# Altium schematic sheet Control_Motor_Ciruit.SchDoc
size A2; Organization: Altium Limited; Address1: L3, 12a Rodborough Rd; Address2: Frenchs Forest; Address3: NSW; Address4: Australia 2086
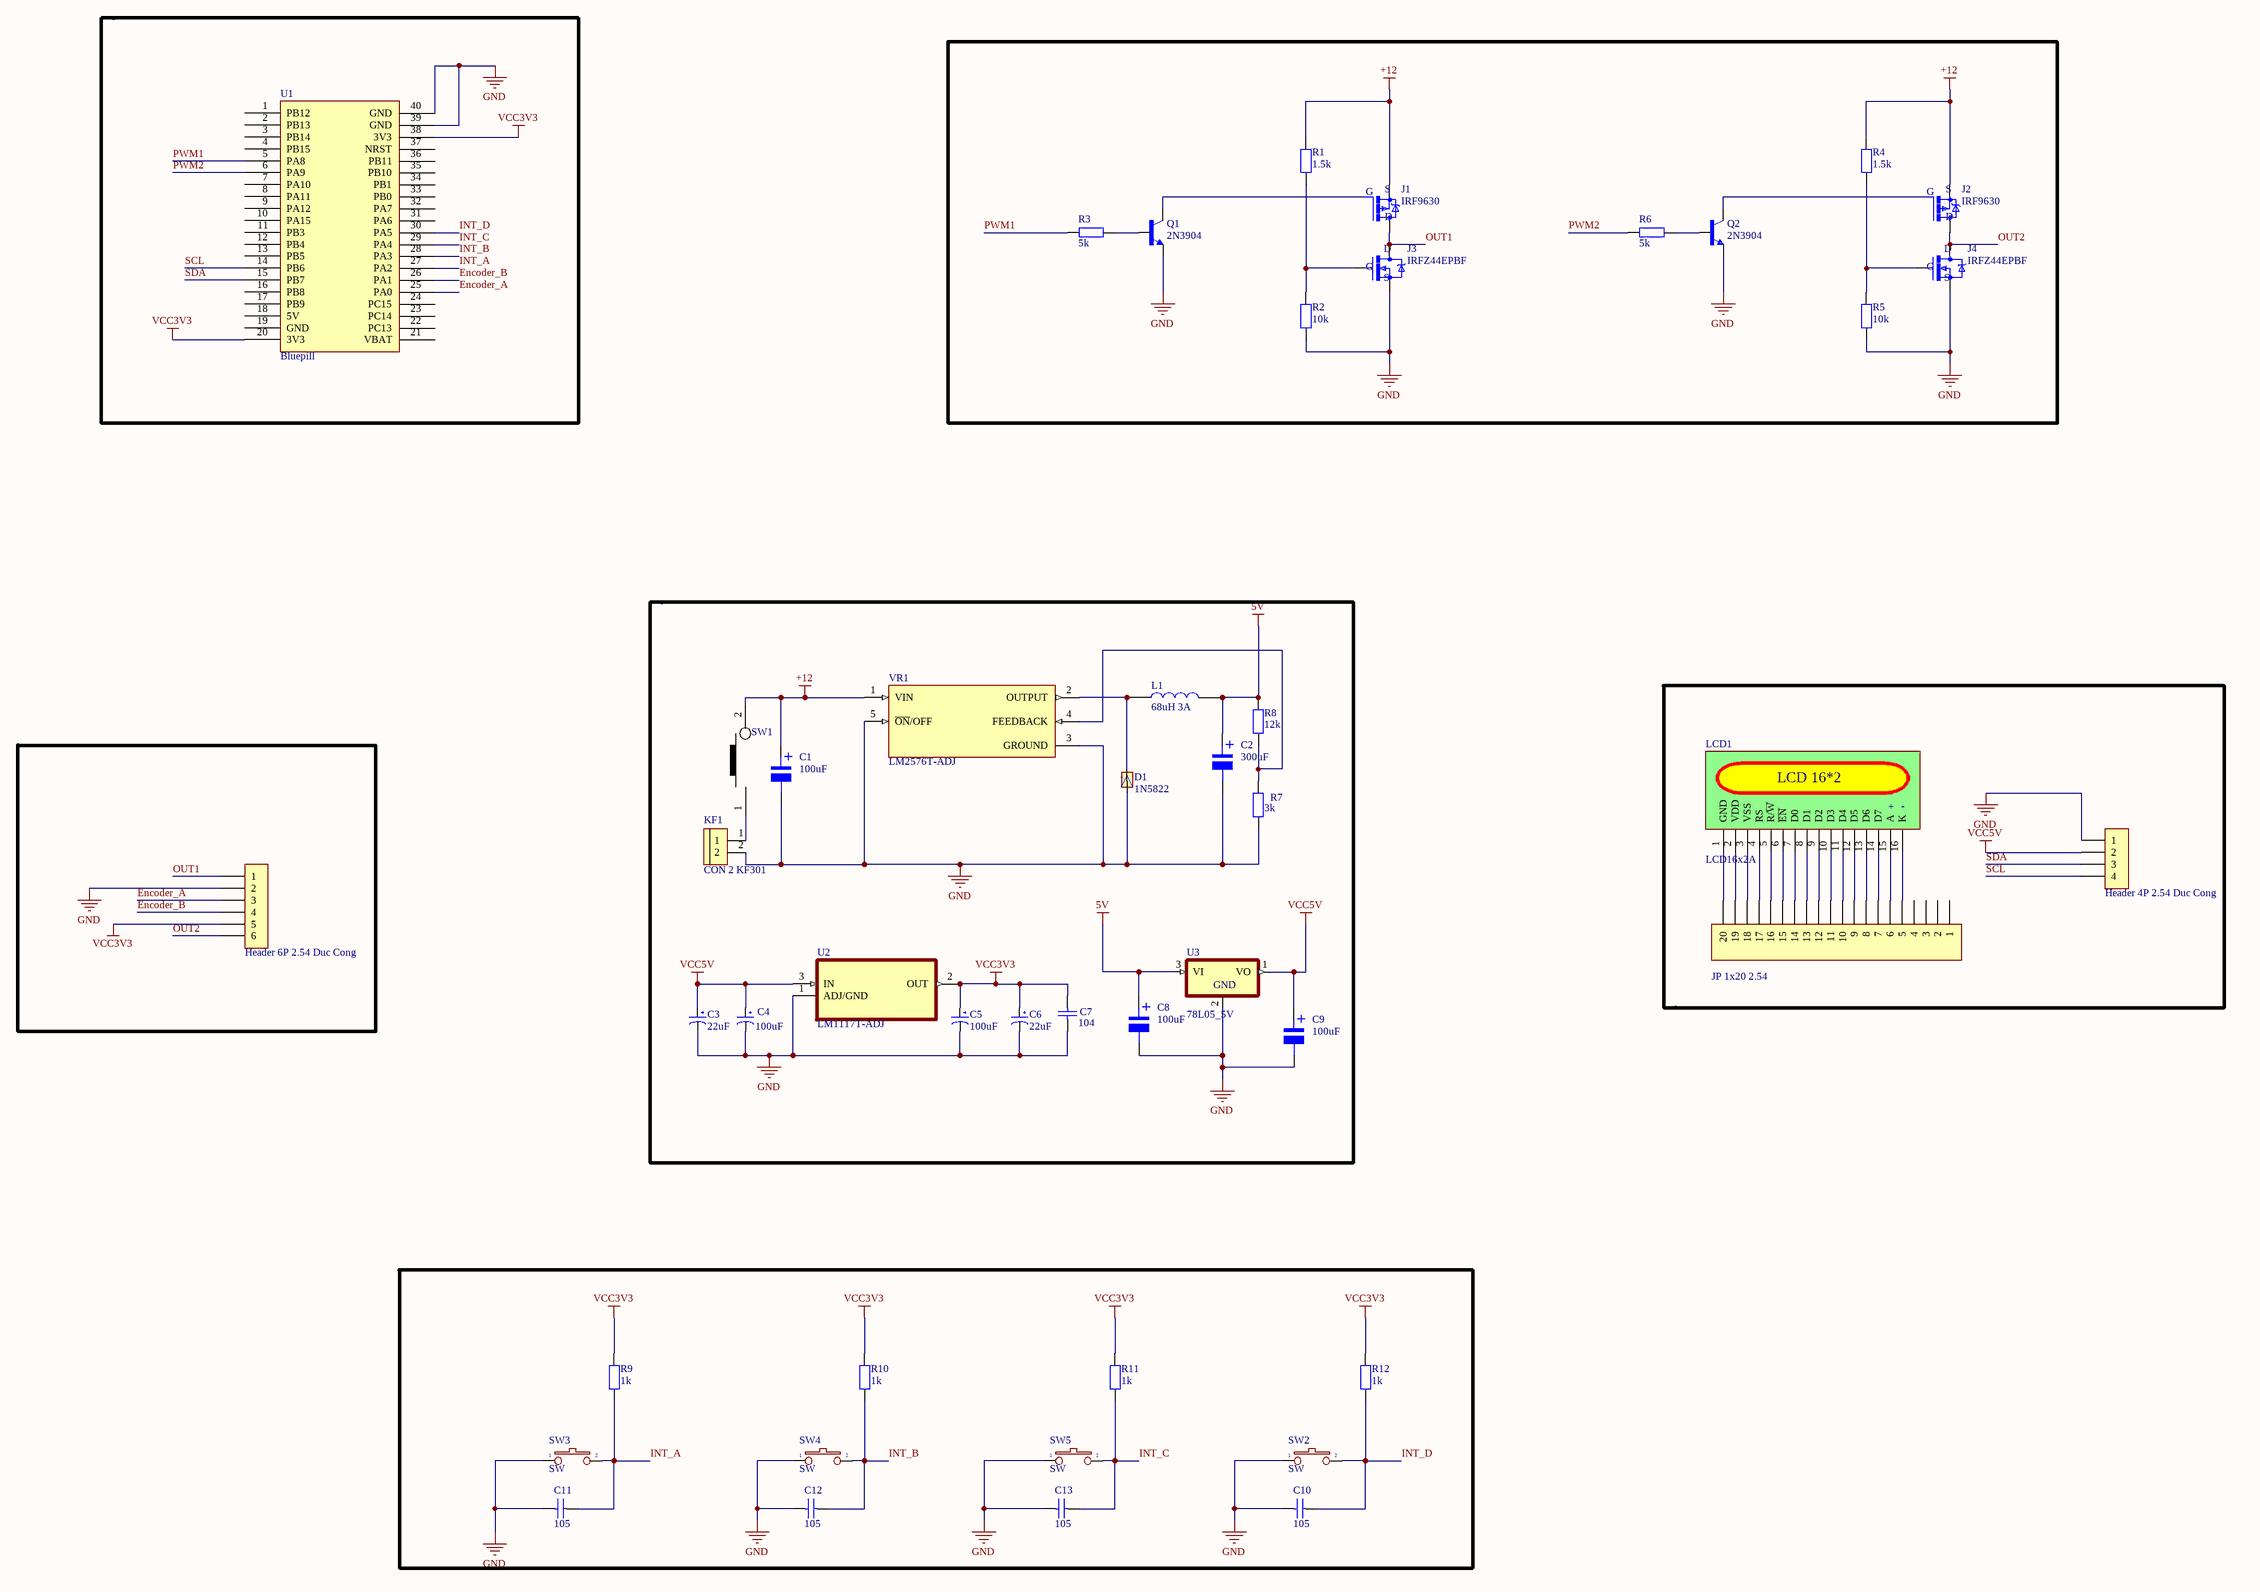
[diagram p0: Control_Motor_Ciruit.SchDoc]

## Parts
C1  100uF  [CA-ALU-5R]
C2  300uF  [CA-ALU-5R]
C3  22uF  [CA-ALU-5R]
C4  100uF  [CA-ALU-5R]
C5  100uF  [CA-ALU-5R]
C6  22uF  [CA-ALU-5R]
C7  104  [CN1]
C8  100uF  [CA-ALU-5R]
C9  100uF  [CA-ALU-5R]
C10  105  [tu gom]
C11  105  [tu gom]
C12  105  [tu gom]
C13  105  [tu gom]
D1  1N5822  [DIOAD2120W130L950D530P]
H1  Header 4P 2.54 Duc Cong  [Header 4P DC 2.54]
H?  Header 6P 2.54 Duc Cong  [Header 6P DC 2.54]
J1  IRF9630  [TO220V]
J2  IRF9630  [TO220V]
J3  IRFZ44EPBF  [TO-220]
J4  IRFZ44EPBF  [TO-220]
JP1  JP 1x20 2.54  [JP 1x20 CT]
KF1  CON 2 KF301  [Con 2 KF301 5.08]
L1  68uH 3A  [CUON CAM 100uH3A]
LCD1  LCD16x2A  [LCD16X2]
Q1  2N3904  [TO92127P495H495-3]
Q2  2N3904  [TO92127P495H495-3]
R1  1.5k  [tro vach 1/4w]
R2  10k  [tro vach 1/4w]
R3  5k  [tro vach 1/4w]
R4  1.5k  [tro vach 1/4w]
R5  10k  [tro vach 1/4w]
R6  5k  [tro vach 1/4w]
R7  3k  [tro vach 1/4w]
R8  12k  [tro vach 1/4w]
R9  1k  [tro vach 1/4w]
R10  1k  [tro vach 1/4w]
R11  1k  [tro vach 1/4w]
R12  1k  [tro vach 1/4w]
SW1  SWITCH 10A-2PIN  [SW_2ARS_TH]  (value not drawn)
SW2  SW  [SW2]
SW3  SW  [SW2]
SW4  SW  [SW2]
SW5  SW  [SW2]
U1  Bluepill  [Blue Pill]
U2  LM1117T-ADJ  [TO254P470X1016X2222-3P]
U3  78L05_5V  [TO-92]
VR1  LM2576T-ADJ  [TO170P1067X483X1651-5]

## Nets
5V: C2.1 C8.1 L1.2 R8.2 U3.3(VI)
+12: C1.1 J1.3(S) J2.3(S) R1.2 R4.2 SW1.2 VR1.1(VIN)
GND: C1.2 C2.2 C3.2 C4.2 C5.2 C6.2 C7.2 C8.2 C9.2 C10.2 C11.2 C12.2 C13.2 D1.A H1.1 H?.2 J3.3(S) J4.3(S) KF1.2 Q1.1(E) Q2.1(E) R2.1 R5.1 R7.1 SW2.1 SW3.1 SW4.1 SW5.1 U1.39(GND) U1.40(GND) U2.1(ADJ/GND) U3.2(GND) VR1.3(GROUND) VR1.5(~{ON}/OFF)
VCC3V3: C5.1 C6.1 C7.1 H?.5 R9.2 R10.2 R11.2 R12.2 U1.20(3V3) U1.38(3V3) U2.2(OUT)
VCC5V: C3.1 C4.1 C9.1 H1.2 U2.3(IN) U3.1(VO)
Encoder_A: H?.3 U1.25(PA0)
Encoder_B: H?.4 U1.26(PA1)
INT_A: C11.1 R9.1 SW3.2 U1.27(PA2)
INT_B: C12.1 R10.1 SW4.2 U1.28(PA3)
INT_C: C13.1 R11.1 SW5.2 U1.29(PA4)
INT_D: C10.1 R12.1 SW2.2 U1.30(PA5)
OUT1: H?.1 J1.2(D) J3.2(D)
OUT2: H?.6 J2.2(D) J4.2(D)
PWM1: R3.2 U1.5(PA8)
PWM2: R6.2 U1.6(PA9)
SCL: H1.4 U1.14(PB6)
SDA: H1.3 U1.15(PB7)
NetD1_C: D1.C L1.1 VR1.2(OUTPUT)
NetJ1_1: J1.1(G) Q1.3(C)
NetJ2_1: J2.1(G) Q2.3(C)
NetJ3_1: J3.1(G) R1.1 R2.2
NetJ4_1: J4.1(G) R4.1 R5.2
NetJP1_5: JP1.5 LCD1.16(K)
NetJP1_6: JP1.6 LCD1.15(A)
NetJP1_7: JP1.7 LCD1.14(D7)
NetJP1_8: JP1.8 LCD1.13(D6)
NetJP1_9: JP1.9 LCD1.12(D5)
NetJP1_10: JP1.10 LCD1.11(D4)
NetJP1_11: JP1.11 LCD1.10(D3)
NetJP1_12: JP1.12 LCD1.9(D2)
NetJP1_13: JP1.13 LCD1.8(D1)
NetJP1_14: JP1.14 LCD1.7(D0)
NetJP1_15: JP1.15 LCD1.6(~{EN})
NetJP1_16: JP1.16 LCD1.5(R/~{W})
NetJP1_17: JP1.17 LCD1.4(RS)
NetJP1_18: JP1.18 LCD1.3(VSS)
NetJP1_19: JP1.19 LCD1.2(VDD)
NetJP1_20: JP1.20 LCD1.1(GND)
NetKF1_1: KF1.1 SW1.1
NetQ1_2: Q1.2(B) R3.1
NetQ2_2: Q2.2(B) R6.1
NetR7_2: R7.2 R8.1 VR1.4(FEEDBACK)

Not connected (* = marked no-connect by the designer): JP1 1 2 3 4; U1 1(PB12) 2(PB13) 3(PB14) 4(PB15) 7(PA10) 8(PA11) 9(PA12) 10(PA15) 11(PB3) 12(PB4) 13(PB5) 16(PB8) 17(PB9) 18(5V) 19(GND) 21(VBAT) 22(PC13) 23(PC14) 24(PC15) 31(PA6) 32(PA7) 33(PB0) 34(PB1) 35(PB10) 36(PB11) 37(NRST)

## Notes on the sheet
- Title
- Size:
- Date:
- File:
- A2
- Number:
- Time:
- Revision:
- Sheet
- of
- (in symbol LCD16x2) LCD 16*2; -; +
- (in symbol Tu Nhom 100uF 16V) +

## Library data of the parts
C1 C2 C8 C9 = Tu Nhom 100uF 16V: Dán; Don_Vi: Con; So_Chan: 2; Ten_Linh_Kien: Tụ Nhôm 100uF 16V 6.3x5.4MM; Ma_Hang: MH002219; Chung_Loai: Dán; Kieu_Chan: *
C3 C6 = Tu tantalum 22uF 25V SMD6032: Dán; Don_Vi: Con; So_Chan: 2; Ten_Linh_Kien: Tụ tantalum 226E-22uF 25V SMD6032; Ma_Hang: MH002651; Chung_Loai: Dán; Kieu_Chan: *
C4 C5 = Tu tantalum 100uF 10V SMD6032: Dán; Don_Vi: Con; So_Chan: 2; Ten_Linh_Kien: Tụ tantalum 107A-100uF 10V SMD6032; Ma_Hang: MH007594; Chung_Loai: Dán; Kieu_Chan: *
C7 = Tu 0603 104 50V 10%: Dán; Don_Vi: Con; So_Chan: 2; Ten_Linh_Kien: Tụ 0603 104-100nF 10% 50V; Ma_Hang: MH004568; Chung_Loai: Dán; Kieu_Chan: *
C10-C13 = Tu gom 104 50V: Cắm; So_Chan: 2; Ten_Linh_Kien: Tụ gốm 104 100nF 50V; Don_Vi: Con; Ma_Hang: MH004761; Chung_Loai: Cắm; Kieu_Chan: *
D1 = 1N5822: Diode Schottky 40 V 3A Through Hole DO-201AD; MF: STMicroelectronics; Value: *; SnapEDA_Link: https://www.snapeda.com/parts/1N5822/STMicroelectronics/view-part/?ref=snap; Purchase-URL: https://pricing.snapeda.com/search/part/1N5822/?ref=eda; Availability: In Stock; Price: None; Package: DO-201 STMicroelectronics; Check_prices: https://www.snapeda.com/parts/1N5822/STMicroelectronics/view-part/?ref=eda; MP: 1N5822
H1 = Header 4P 2.54 Duc Cong: Cắm; Ten_Linh_Kien: Header 4P XH2.54-4P Đực Cong; Don_Vi: Con; Ma_Hang: MH001310; Chung_Loai: Cắm
H? = Header 6P 2.54 Duc Cong: Cắm; Ten_Linh_Kien: Header 6P XH2.54-6P Đực Cong; Don_Vi: Con; Ma_Hang: MH003363; Chung_Loai: Cắm
J1 J2 = IRF9630: Trans MOSFET P-CH 200V 6.5A 3-Pin(3+Tab) TO-220AB Trans MOSFET P-CH 200V 6.5A 3-Pin(3+Tab) TO-220AB Trans MOSFET P-CH 200V 6.5A 3-Pin(3+Tab) TO-220AB; MF: Vishay Siliconix; MP: IRF9630; SnapEDA_Link: https://www.snapeda.com/parts/IRF9630/Vishay+Siliconix/view-part/?ref=snap; Availability: In Stock; Package: TO-220-3 Vishay; Purchase-URL: https://pricing.snapeda.com/search/part/IRF9630/?ref=eda; Check_prices: https://www.snapeda.com/parts/IRF9630/Vishay+Siliconix/view-part/?ref=eda; Value: *; Price: None
J3 J4 = IRFZ44EPBF: N-Channel 60 V 48A (Tc) 110W (Tc) Through Hole TO-220AB; MF: Infineon; Purchase-URL: https://pricing.snapeda.com/search/part/IRFZ44EPBF/?ref=eda; MP: IRFZ44EPBF; Value: *; Check_prices: https://www.snapeda.com/parts/IRFZ44EPBF/Infineon+Technologies/view-part/?ref=eda; Package: TO-220-3 Infineon; Price: None; Availability: In Stock; SnapEDA_Link: https://www.snapeda.com/parts/IRFZ44EPBF/Infineon+Technologies/view-part/?ref=snap
JP1 = JP 1x20 2.54 Cai Thang: Cắm; Ten_Linh_Kien: Jump Đơn Cái 2.54MM 1x20P Thẳng; Don_Vi: Con; Ma_Hang: MH004006; Ghi_Chu: *; Kieu_Chan: *; Chung_Loai: Cắm
KF1 = CON 2 KF301: Cắm; Ma_Hang: MH000987; Ten_Linh_Kien: CON 2 KF301-2P 5.08MM Xanh Dương; Chung_Loai: Cắm; Ghi_Chu: *; Kieu_Chan: *; Don_Vi: Con
L1 = CUON CAM 100uH DIP: Dán; Don_Vi: Con; Ma_Hang: MH002209; Ten_Linh_Kien: Cuộn Cảm 100uH 3A 8x10MM; Chung_Loai: Dán; Ghi Chu: *; Kieu Chan: *
LCD1 = LCD16x2: LCD dipslay 16 char, 2 line; Value: LCD16x2A
Q1 Q2 = 2N3904: TRANS NPN 40V 200MA TO92-3; MF: Rectron; SnapEDA_Link: https://www.snapeda.com/parts/2N3904/Rectron/view-part/?ref=snap; Package: TO-226-3 Rectron; MP: 2N3904; Check_prices: https://www.snapeda.com/parts/2N3904/Rectron/view-part/?ref=eda; Purchase-URL: https://pricing.snapeda.com/search/part/2N3904/?ref=eda; Price: None; Value: *; Availability: In Stock
R1 R3 R4 R6 = Tro Vach 1/4W 5% 1.5k: Cắm; Don_Vi: Con; So_Chan: 2; Ten_Linh_Kien: Trở Vạch 1/4w 5% 1.5k; Ma_Hang: MH007284; Chung_Loai: Cắm; Kieu_Chan: *
R2 R5 R9-R12 = Tro Vach 1/4W 5% 10k: Căm; Chung_Loai: Cắm; Don_Vi: Con; So_Chan: 2; Ten_Linh_Kien: Trở Vạch 1/4w 5% 10K; Ma_Hang: MH007354; Kieu_Chan: *
R7 = Tro Vach 1/4W 5% 2.2k: Cắm; Don_Vi: Con; So_Chan: 2; Ten_Linh_Kien: Trở Vạch 1/4w 5% 2.2k; Ma_Hang: MH007293; Chung_Loai: Cắm; Kieu_Chan: *
R8 = Tro Vach 1/4W 5% 12k: Cắm; Don_Vi: Con; So_Chan: 2; Ma_Hang: MH007389; Ten_Linh_Kien: Trở Vạch 1/4w 5% 12k; Chung_Loai: Cắm; Kieu_Chan: *
SW1 = SW1_RS-471005264153-TH: Rocker Switch SPST 16A (AC), 10A (DC) 250V Panel Mount, Snap-In; Manufacturer: Würth Elektronik; Alternate Part Number-1: NA; Manufacturer Part Number: 471005264153; Case/Package: TH; Supplier-1: Würth Elektronik; Supplier Part Number-1: 471005264153
SW2-SW5 = SW2: Switch button 2 pin; Value: SW chip 2 pin
U1 = STM32F103C8T6
U2 = LM1117T-ADJ: Linear Voltage Regulator IC 1 Output 800mA TO-220-3; MP: LM1117TADJ; MF: Texas Instruments; SnapEDA_Link: https://www.snapeda.com/parts/LM1117TADJ/Texas%20Instruments/view-part/20524/?ref=snap; Value: *; Price: None; Package: TO-220 National Semiconductor; Availability: Unavailable
U3 = 78L05ACZ: Linear Voltage Regulator IC Positive Fixed 1 Output 100mA TO-92-3; MF: STMicroelectronics; SnapEDA_Link: https://www.snapeda.com/parts/78L05ACZ/STMicroelectronics/view-part/?ref=snap; Package: TO-92 ON; MP: 78L05ACZ; Check_prices: https://www.snapeda.com/parts/78L05ACZ/STMicroelectronics/view-part/?ref=eda; Purchase-URL: https://pricing.snapeda.com/search/part/78L05ACZ/?ref=eda; Price: None; Value: *; Availability: In Stock
VR1 = LM2576T-ADJ: SIMPLE SWITCHER&reg; 40V, 3A Low Component Count Step-Down Regulator 5-TO-220 -40 to 125; MF: Texas Instruments; Availability: In Stock; SnapEDA_Link: https://www.snapeda.com/parts/LM2576T-ADJ/Texas+Instruments/view-part/?ref=snap; Price: None; MP: LM2576T-ADJ; Package: TO-220-5 Texas Instruments; Value: *; Purchase-URL: https://pricing.snapeda.com/search/part/LM2576T-ADJ/?ref=eda; Check_prices: https://www.snapeda.com/parts/LM2576T-ADJ/Texas+Instruments/view-part/?ref=eda